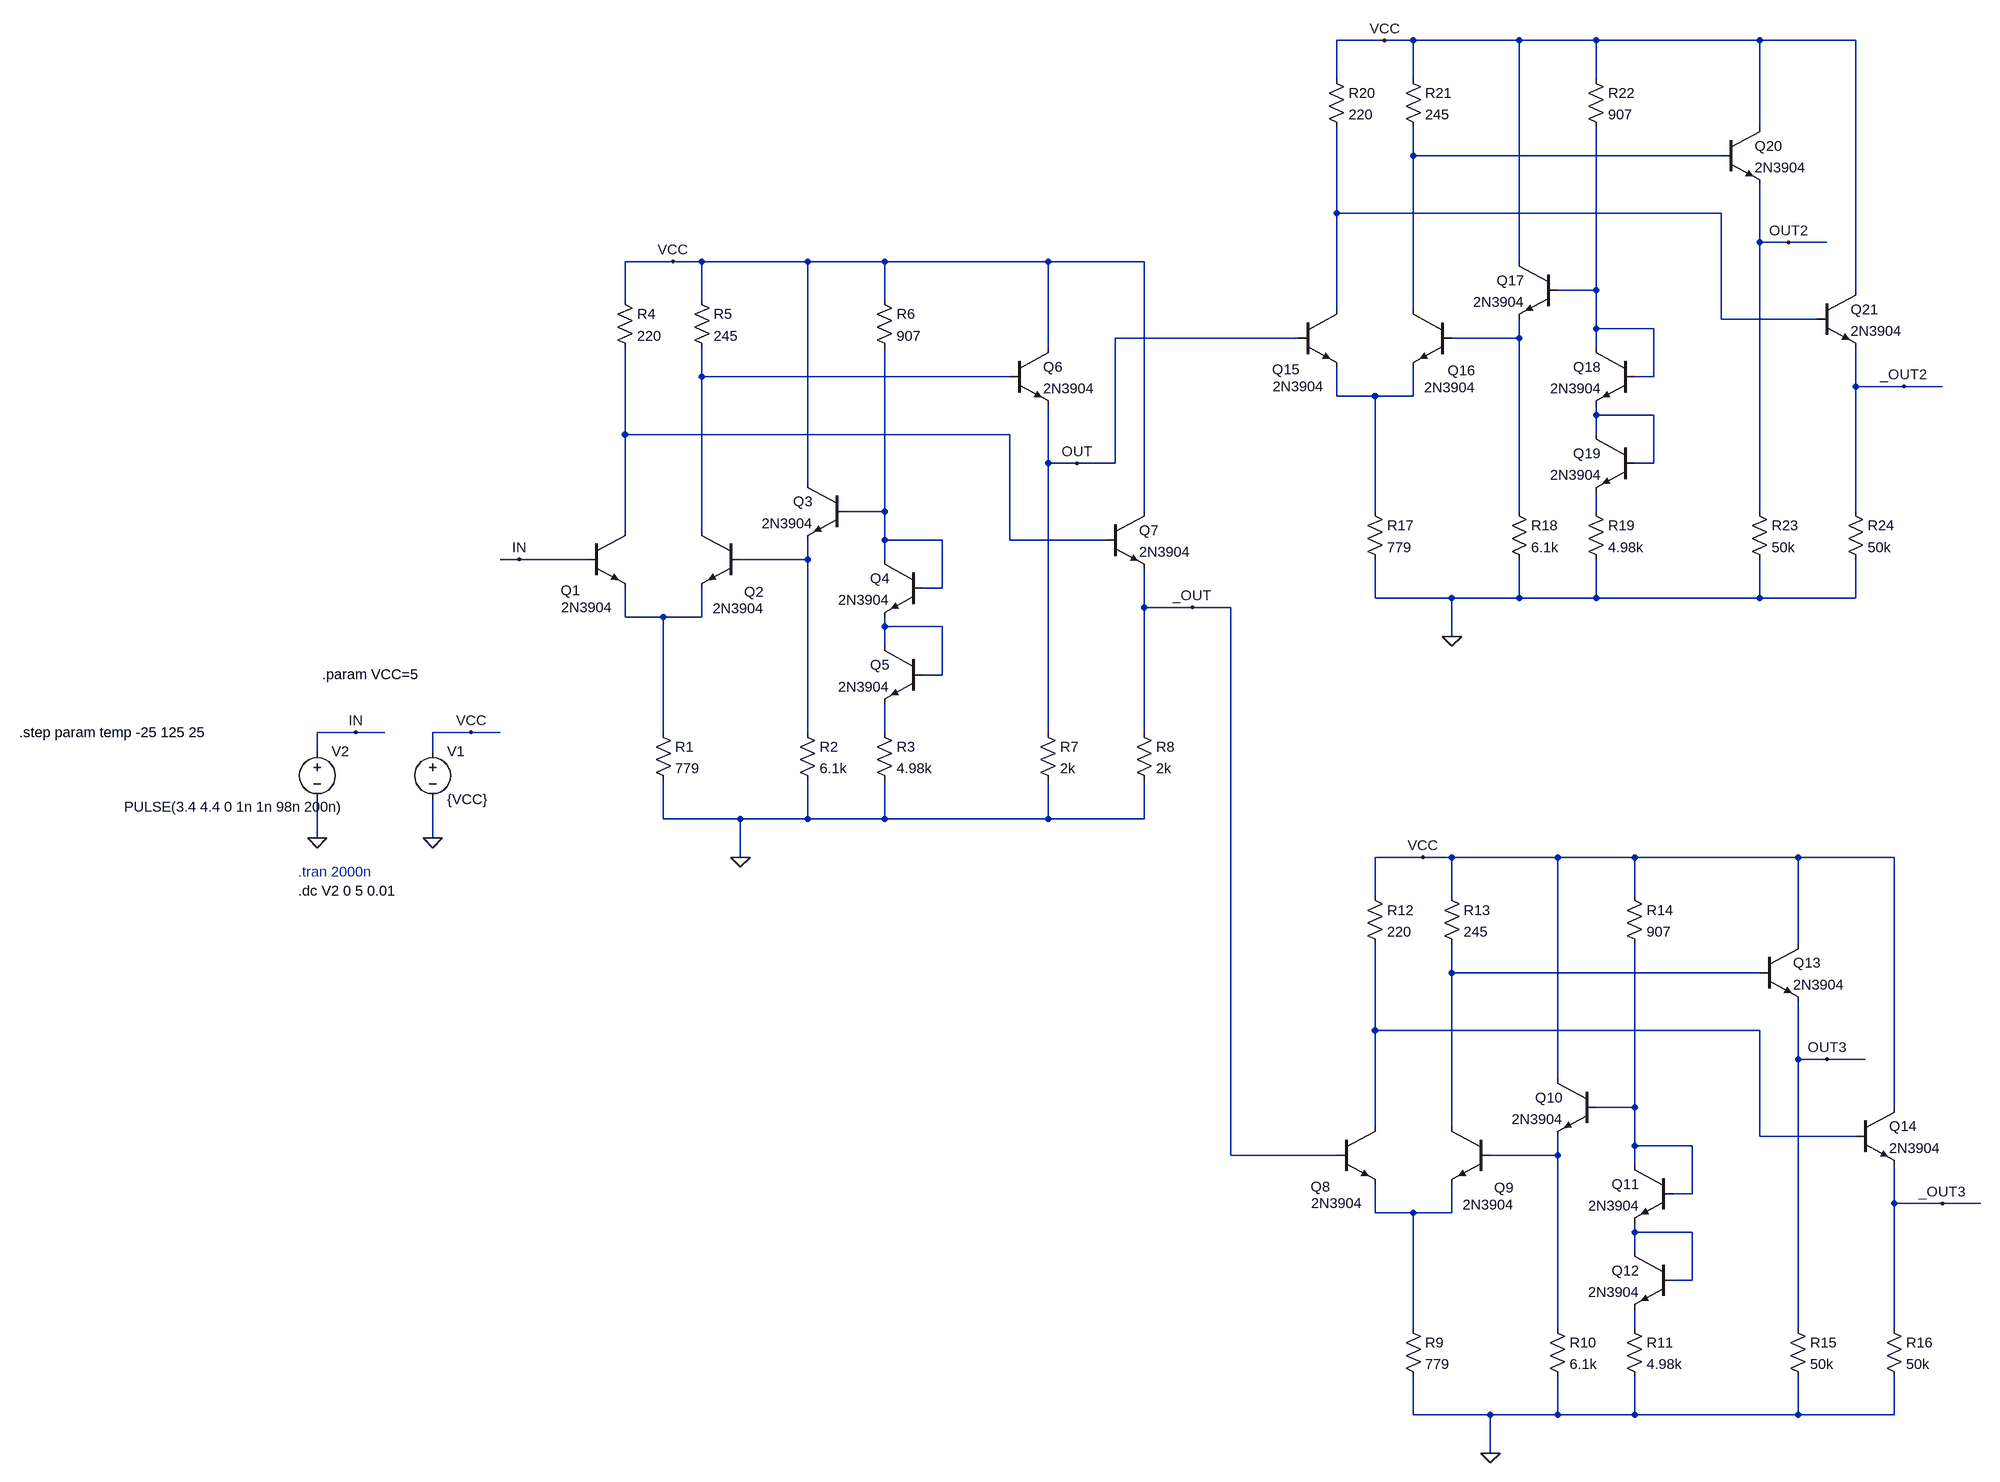
[diagram p0: schematic ecl_gates.asc]
ecl_gates.asc, the LTspice schematic file:
Version 4.1
SHEET 1 2468 1684
WIRE 1472 -688 1392 -688
WIRE 1520 -688 1472 -688
WIRE 1696 -688 1520 -688
WIRE 1824 -688 1696 -688
WIRE 2096 -688 1824 -688
WIRE 2256 -688 2096 -688
WIRE 1392 -624 1392 -688
WIRE 1520 -624 1520 -688
WIRE 1824 -624 1824 -688
WIRE 2096 -544 2096 -688
WIRE 1520 -496 1520 -544
WIRE 2032 -496 1520 -496
WIRE 1392 -400 1392 -544
WIRE 2032 -400 1392 -400
WIRE 2096 -352 2096 -448
WIRE 2144 -352 2096 -352
WIRE 2208 -352 2144 -352
WIRE 288 -320 208 -320
WIRE 336 -320 288 -320
WIRE 512 -320 336 -320
WIRE 640 -320 512 -320
WIRE 912 -320 640 -320
WIRE 1072 -320 912 -320
WIRE 1696 -320 1696 -688
WIRE 1824 -272 1824 -544
WIRE 1824 -272 1760 -272
WIRE 2256 -272 2256 -688
WIRE 208 -256 208 -320
WIRE 336 -256 336 -320
WIRE 640 -256 640 -320
WIRE 1392 -240 1392 -400
WIRE 1520 -240 1520 -496
WIRE 2032 -224 2032 -400
WIRE 2192 -224 2032 -224
WIRE 1824 -208 1824 -272
WIRE 1920 -208 1824 -208
WIRE 1328 -192 1024 -192
WIRE 1696 -192 1696 -224
WIRE 1696 -192 1584 -192
WIRE 912 -176 912 -320
WIRE 1824 -176 1824 -208
WIRE 336 -128 336 -176
WIRE 848 -128 336 -128
WIRE 1920 -128 1920 -208
WIRE 1920 -128 1888 -128
WIRE 2256 -112 2256 -176
WIRE 2336 -112 2256 -112
WIRE 2400 -112 2336 -112
WIRE 1392 -96 1392 -144
WIRE 1456 -96 1392 -96
WIRE 1520 -96 1520 -144
WIRE 1520 -96 1456 -96
WIRE 1824 -64 1824 -80
WIRE 1920 -64 1824 -64
WIRE 208 -32 208 -176
WIRE 848 -32 208 -32
WIRE 1824 -32 1824 -64
WIRE 912 16 912 -80
WIRE 960 16 912 16
WIRE 1024 16 1024 -192
WIRE 1024 16 960 16
WIRE 1920 16 1920 -64
WIRE 1920 16 1888 16
WIRE 512 48 512 -320
WIRE 640 96 640 -176
WIRE 640 96 576 96
WIRE 1072 96 1072 -320
WIRE 1456 96 1456 -96
WIRE 1696 96 1696 -192
WIRE 1824 96 1824 64
WIRE 2096 96 2096 -352
WIRE 2256 96 2256 -112
WIRE 208 128 208 -32
WIRE 336 128 336 -128
WIRE 640 144 640 96
WIRE 736 144 640 144
WIRE 848 144 848 -32
WIRE 1008 144 848 144
WIRE 32 176 0 176
WIRE 144 176 32 176
WIRE 512 176 512 144
WIRE 512 176 400 176
WIRE 640 176 640 144
WIRE 736 224 736 144
WIRE 736 224 704 224
WIRE 1456 240 1456 176
WIRE 1584 240 1456 240
WIRE 1696 240 1696 176
WIRE 1696 240 1584 240
WIRE 1824 240 1824 176
WIRE 1824 240 1696 240
WIRE 2096 240 2096 176
WIRE 2096 240 1824 240
WIRE 2256 240 2256 176
WIRE 2256 240 2096 240
WIRE 1072 256 1072 192
WIRE 1152 256 1072 256
WIRE 1216 256 1152 256
WIRE 208 272 208 224
WIRE 272 272 208 272
WIRE 336 272 336 224
WIRE 336 272 272 272
WIRE 640 288 640 272
WIRE 736 288 640 288
WIRE 1584 304 1584 240
WIRE 640 320 640 288
WIRE 736 368 736 288
WIRE 736 368 704 368
WIRE -240 464 -304 464
WIRE -192 464 -240 464
WIRE -48 464 -112 464
WIRE 0 464 -48 464
WIRE 272 464 272 272
WIRE 512 464 512 176
WIRE 640 464 640 416
WIRE 912 464 912 16
WIRE 1072 464 1072 256
WIRE -304 496 -304 464
WIRE -112 496 -112 464
WIRE 272 608 272 544
WIRE 400 608 272 608
WIRE 512 608 512 544
WIRE 512 608 400 608
WIRE 640 608 640 544
WIRE 640 608 512 608
WIRE 912 608 912 544
WIRE 912 608 640 608
WIRE 1072 608 1072 544
WIRE 1072 608 912 608
WIRE -304 640 -304 576
WIRE -112 640 -112 576
WIRE 400 672 400 608
WIRE 1536 672 1456 672
WIRE 1584 672 1536 672
WIRE 1760 672 1584 672
WIRE 1888 672 1760 672
WIRE 2160 672 1888 672
WIRE 2320 672 2160 672
WIRE 1456 736 1456 672
WIRE 1584 736 1584 672
WIRE 1888 736 1888 672
WIRE 2160 816 2160 672
WIRE 1584 864 1584 816
WIRE 2096 864 1584 864
WIRE 1456 960 1456 816
WIRE 2096 960 1456 960
WIRE 2160 1008 2160 912
WIRE 2208 1008 2160 1008
WIRE 2272 1008 2208 1008
WIRE 1760 1040 1760 672
WIRE 1888 1088 1888 816
WIRE 1888 1088 1824 1088
WIRE 2320 1088 2320 672
WIRE 1456 1120 1456 960
WIRE 1584 1120 1584 864
WIRE 2096 1136 2096 960
WIRE 2256 1136 2096 1136
WIRE 1888 1152 1888 1088
WIRE 1984 1152 1888 1152
WIRE 1216 1168 1216 256
WIRE 1392 1168 1216 1168
WIRE 1760 1168 1760 1136
WIRE 1760 1168 1648 1168
WIRE 1888 1184 1888 1152
WIRE 1984 1232 1984 1152
WIRE 1984 1232 1952 1232
WIRE 2320 1248 2320 1184
WIRE 2400 1248 2320 1248
WIRE 2464 1248 2400 1248
WIRE 1456 1264 1456 1216
WIRE 1520 1264 1456 1264
WIRE 1584 1264 1584 1216
WIRE 1584 1264 1520 1264
WIRE 1888 1296 1888 1280
WIRE 1984 1296 1888 1296
WIRE 1888 1328 1888 1296
WIRE 1984 1376 1984 1296
WIRE 1984 1376 1952 1376
WIRE 1520 1456 1520 1264
WIRE 1760 1456 1760 1168
WIRE 1888 1456 1888 1424
WIRE 2160 1456 2160 1008
WIRE 2320 1456 2320 1248
WIRE 1520 1600 1520 1536
WIRE 1648 1600 1520 1600
WIRE 1760 1600 1760 1536
WIRE 1760 1600 1648 1600
WIRE 1888 1600 1888 1536
WIRE 1888 1600 1760 1600
WIRE 2160 1600 2160 1536
WIRE 2160 1600 1888 1600
WIRE 2320 1600 2320 1536
WIRE 2320 1600 2160 1600
WIRE 1648 1664 1648 1600
FLAG 400 672 0
FLAG -112 640 0
FLAG -48 464 VCC
FLAG 288 -320 VCC
FLAG -304 640 0
FLAG -240 464 IN
FLAG 32 176 IN
FLAG 960 16 OUT
FLAG 1152 256 _OUT
FLAG 1648 1664 0
FLAG 1536 672 VCC
FLAG 2208 1008 OUT3
FLAG 2400 1248 _OUT3
FLAG 1584 304 0
FLAG 1472 -688 VCC
FLAG 2144 -352 OUT2
FLAG 2336 -112 _OUT2
SYMBOL npn 144 128 R0
WINDOW 0 -43 100 Left 2
WINDOW 3 -42 128 Left 2
SYMATTR InstName Q1
SYMATTR Value 2N3904
SYMBOL npn 400 128 M0
WINDOW 0 -39 102 Left 2
WINDOW 3 -39 130 Left 2
SYMATTR InstName Q2
SYMATTR Value 2N3904
SYMBOL npn 576 48 M0
SYMATTR InstName Q3
SYMATTR Value 2N3904
SYMBOL res 256 448 R0
SYMATTR InstName R1
SYMATTR Value 779
SYMBOL res 496 448 R0
SYMATTR InstName R2
SYMATTR Value 6.1k
SYMBOL res 624 448 R0
SYMATTR InstName R3
SYMATTR Value 4.98k
SYMBOL res 192 -272 R0
SYMATTR InstName R4
SYMATTR Value 220
SYMBOL res 320 -272 R0
SYMATTR InstName R5
SYMATTR Value 245
SYMBOL res 624 -272 R0
SYMATTR InstName R6
SYMATTR Value 907
SYMBOL npn 848 -176 R0
SYMATTR InstName Q6
SYMATTR Value 2N3904
SYMBOL res 896 448 R0
SYMATTR InstName R7
SYMATTR Value 2k
SYMBOL voltage -112 480 R0
WINDOW 123 0 0 Left 0
WINDOW 39 0 0 Left 0
SYMATTR InstName V1
SYMATTR Value {VCC}
SYMBOL voltage -304 480 R0
WINDOW 3 -321 108 Left 2
WINDOW 123 0 0 Left 0
WINDOW 39 0 0 Left 0
SYMATTR InstName V2
SYMATTR Value PULSE(3.4 4.4 0 1n 1n 98n 200n)
SYMBOL npn 1008 96 R0
SYMATTR InstName Q7
SYMATTR Value 2N3904
SYMBOL res 1056 448 R0
SYMATTR InstName R8
SYMATTR Value 2k
SYMBOL npn 1392 1120 R0
WINDOW 0 -43 100 Left 2
WINDOW 3 -42 128 Left 2
SYMATTR InstName Q8
SYMATTR Value 2N3904
SYMBOL npn 1648 1120 M0
WINDOW 0 -39 102 Left 2
WINDOW 3 -39 130 Left 2
SYMATTR InstName Q9
SYMATTR Value 2N3904
SYMBOL npn 1824 1040 M0
SYMATTR InstName Q10
SYMATTR Value 2N3904
SYMBOL npn 1952 1184 M0
SYMATTR InstName Q11
SYMATTR Value 2N3904
SYMBOL npn 1952 1328 M0
SYMATTR InstName Q12
SYMATTR Value 2N3904
SYMBOL res 1504 1440 R0
SYMATTR InstName R9
SYMATTR Value 779
SYMBOL res 1744 1440 R0
SYMATTR InstName R10
SYMATTR Value 6.1k
SYMBOL res 1872 1440 R0
SYMATTR InstName R11
SYMATTR Value 4.98k
SYMBOL res 1440 720 R0
SYMATTR InstName R12
SYMATTR Value 220
SYMBOL res 1568 720 R0
SYMATTR InstName R13
SYMATTR Value 245
SYMBOL res 1872 720 R0
SYMATTR InstName R14
SYMATTR Value 907
SYMBOL npn 2096 816 R0
SYMATTR InstName Q13
SYMATTR Value 2N3904
SYMBOL res 2144 1440 R0
SYMATTR InstName R15
SYMATTR Value 50k
SYMBOL npn 2256 1088 R0
SYMATTR InstName Q14
SYMATTR Value 2N3904
SYMBOL res 2304 1440 R0
SYMATTR InstName R16
SYMATTR Value 50k
SYMBOL npn 1328 -240 R0
WINDOW 0 -43 100 Left 2
WINDOW 3 -42 128 Left 2
SYMATTR InstName Q15
SYMATTR Value 2N3904
SYMBOL npn 1584 -240 M0
WINDOW 0 -39 102 Left 2
WINDOW 3 -39 130 Left 2
SYMATTR InstName Q16
SYMATTR Value 2N3904
SYMBOL npn 1760 -320 M0
SYMATTR InstName Q17
SYMATTR Value 2N3904
SYMBOL npn 1888 -176 M0
SYMATTR InstName Q18
SYMATTR Value 2N3904
SYMBOL npn 1888 -32 M0
SYMATTR InstName Q19
SYMATTR Value 2N3904
SYMBOL res 1440 80 R0
SYMATTR InstName R17
SYMATTR Value 779
SYMBOL res 1680 80 R0
SYMATTR InstName R18
SYMATTR Value 6.1k
SYMBOL res 1808 80 R0
SYMATTR InstName R19
SYMATTR Value 4.98k
SYMBOL res 1376 -640 R0
SYMATTR InstName R20
SYMATTR Value 220
SYMBOL res 1504 -640 R0
SYMATTR InstName R21
SYMATTR Value 245
SYMBOL res 1808 -640 R0
SYMATTR InstName R22
SYMATTR Value 907
SYMBOL npn 2032 -544 R0
SYMATTR InstName Q20
SYMATTR Value 2N3904
SYMBOL res 2080 80 R0
SYMATTR InstName R23
SYMATTR Value 50k
SYMBOL npn 2192 -272 R0
SYMATTR InstName Q21
SYMATTR Value 2N3904
SYMBOL res 2240 80 R0
SYMATTR InstName R24
SYMATTR Value 50k
SYMBOL npn 704 176 M0
SYMATTR InstName Q4
SYMATTR Value 2N3904
SYMBOL npn 704 320 M0
SYMATTR InstName Q5
SYMATTR Value 2N3904
TEXT -336 696 Left 2 ;.tran 2000n
TEXT -296 368 Left 2 !.param VCC=5
TEXT -336 728 Left 2 !.dc V2 0 5 0.01
TEXT -800 464 Left 2 !.step param temp -25 125 25

The netlist it stands for:
* ecl_gates.asc
Q1 N008 IN N012 0 2N3904
Q2 N005 N011 N012 0 2N3904
Q3 VCC N009 N011 0 2N3904
R1 N012 0 779
R2 N011 0 6.1k
R3 N014 0 4.98k
R4 VCC N008 220
R5 VCC N005 245
R6 VCC N009 907
Q6 VCC N005 OUT 0 2N3904
R7 OUT 0 2k
V1 VCC 0 {VCC}
V2 IN 0 PULSE(3.4 4.4 0 1n 1n 98n 200n)
Q7 VCC N008 _OUT 0 2N3904
R8 _OUT 0 2k
Q8 N016 _OUT N019 0 2N3904
Q9 N015 N018 N019 0 2N3904
Q10 VCC N017 N018 0 2N3904
Q11 N017 N017 N020 0 2N3904
Q12 N020 N020 N021 0 2N3904
R9 N019 0 779
R10 N018 0 6.1k
R11 N021 0 4.98k
R12 VCC N016 220
R13 VCC N015 245
R14 VCC N017 907
Q13 VCC N015 OUT3 0 2N3904
R15 OUT3 0 50k
Q14 VCC N016 _OUT3 0 2N3904
R16 _OUT3 0 50k
Q15 N002 OUT N006 0 2N3904
Q16 N001 N004 N006 0 2N3904
Q17 VCC N003 N004 0 2N3904
Q18 N003 N003 N007 0 2N3904
Q19 N007 N007 N010 0 2N3904
R17 N006 0 779
R18 N004 0 6.1k
R19 N010 0 4.98k
R20 VCC N002 220
R21 VCC N001 245
R22 VCC N003 907
Q20 VCC N001 OUT2 0 2N3904
R23 OUT2 0 50k
Q21 VCC N002 _OUT2 0 2N3904
R24 _OUT2 0 50k
Q4 N009 N009 N013 0 2N3904
Q5 N013 N013 N014 0 2N3904
.model NPN NPN
.model PNP PNP
.lib standard.bjt
* .tran 2000n
.param VCC=5
.dc V2 0 5 0.01
.step param temp -25 125 25
.backanno
.end